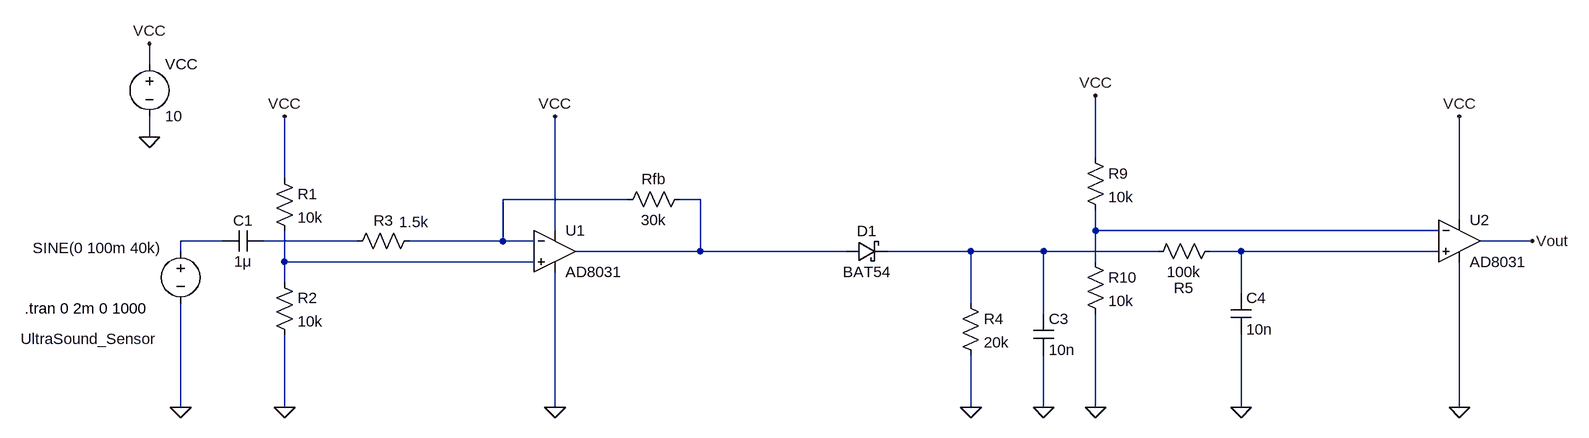
[diagram p0: schematic Ultrasound.asc]
Ultrasound.asc, the LTspice schematic file:
Version 4
SHEET 1 1844 680
WIRE -400 -144 -400 -176
WIRE -400 -32 -400 -64
WIRE 1056 0 1056 -96
WIRE -192 32 -192 -64
WIRE 336 64 144 64
WIRE 448 64 416 64
WIRE 1616 96 1616 -64
WIRE 224 112 224 -64
WIRE 1056 112 1056 80
WIRE 1584 112 1056 112
WIRE -288 128 -352 128
WIRE -80 128 -224 128
WIRE 144 128 144 64
WIRE 144 128 0 128
WIRE 192 128 144 128
WIRE 1728 128 1648 128
WIRE -352 144 -352 128
WIRE 448 144 448 64
WIRE 448 144 256 144
WIRE 672 144 448 144
WIRE 864 144 736 144
WIRE 976 144 864 144
WIRE 1152 144 976 144
WIRE 1280 144 1232 144
WIRE 1584 144 1280 144
WIRE -192 160 -192 112
WIRE 192 160 -192 160
WIRE 1056 160 1056 112
WIRE -192 192 -192 160
WIRE 1280 208 1280 144
WIRE 864 224 864 144
WIRE 976 240 976 144
WIRE -352 384 -352 224
WIRE -192 384 -192 272
WIRE 224 384 224 176
WIRE 864 384 864 304
WIRE 976 384 976 304
WIRE 1056 384 1056 240
WIRE 1280 384 1280 272
WIRE 1616 384 1616 160
FLAG 224 384 0
FLAG -192 384 0
FLAG -352 384 0
FLAG -400 -32 0
FLAG -400 -176 VCC
FLAG 224 -64 VCC
FLAG -192 -64 VCC
FLAG 864 384 0
FLAG 976 384 0
FLAG 1280 384 0
FLAG 1616 384 0
FLAG 1056 384 0
FLAG 1056 -96 VCC
FLAG 1616 -64 VCC
FLAG 1728 128 Vout
SYMBOL OpAmps\\AD8031 224 80 R0
SYMATTR InstName U1
SYMBOL res -208 16 R0
SYMATTR InstName R1
SYMATTR Value 10k
SYMBOL res -208 176 R0
SYMATTR InstName R2
SYMATTR Value 10k
SYMBOL voltage -352 128 R0
WINDOW 3 -228 11 Left 2
WINDOW 123 0 0 Left 0
WINDOW 39 0 0 Left 0
WINDOW 0 -246 151 Left 2
SYMATTR Value SINE(0 100m 40k)
SYMATTR InstName UltraSound_Sensor
SYMBOL res 16 112 R90
WINDOW 0 0 56 VBottom 2
WINDOW 3 -29 9 VTop 2
SYMATTR InstName R3
SYMATTR Value 1.5k
SYMBOL cap -224 112 R90
WINDOW 0 0 32 VBottom 2
WINDOW 3 32 32 VTop 2
SYMATTR InstName C1
SYMATTR Value 1μ
SYMBOL res 432 48 R90
WINDOW 0 0 56 VBottom 2
WINDOW 3 32 56 VTop 2
SYMATTR InstName Rfb
SYMATTR Value 30k
SYMBOL voltage -400 -160 R0
SYMATTR InstName VCC
SYMATTR Value 10
SYMBOL res 848 208 R0
SYMATTR InstName R4
SYMATTR Value 20k
SYMBOL cap 960 240 R0
SYMATTR InstName C3
SYMATTR Value 10n
SYMBOL schottky 672 160 R270
WINDOW 0 32 32 VTop 2
WINDOW 3 0 32 VBottom 2
SYMATTR InstName D1
SYMATTR Value BAT54
SYMBOL res 1248 128 R90
WINDOW 0 88 56 VBottom 2
WINDOW 3 32 56 VTop 2
SYMATTR InstName R5
SYMATTR Value 100k
SYMBOL cap 1264 208 R0
SYMATTR InstName C4
SYMATTR Value 10n
SYMBOL OpAmps\\AD8031 1616 64 R0
SYMATTR InstName U2
SYMBOL res 1040 -16 R0
SYMATTR InstName R9
SYMATTR Value 10k
SYMBOL res 1040 144 R0
SYMATTR InstName R10
SYMATTR Value 10k
TEXT -592 232 Left 2 !.tran 0 2m 0 1000

The netlist it stands for:
* Ultrasound.asc
XU1 N008 N001 VCC 0 N002 AD8031  ; pins In+ In- V+ V- OUT
R1 VCC N008 10k
R2 N008 0 10k
V§UltraSound_Sensor N004 0 SINE(0 100m 40k)
R3 N001 N005 1.5k
C1 N005 N004 1μ
Rfb N002 N001 30k
VCC VCC 0 10
R4 N006 0 20k
C3 N006 0 10n
D1 N002 N006 BAT54
R5 N007 N006 100k
C4 N007 0 10n
XU2 N007 N003 VCC 0 Vout AD8031  ; pins In+ In- V+ V- OUT
R9 VCC N003 10k
R10 N003 0 10k
.model D D
.lib standard.dio
.tran 0 2m 0 1000
.backanno
.end